# EAGLE design sensor-small (EAGLE 9.6.2)
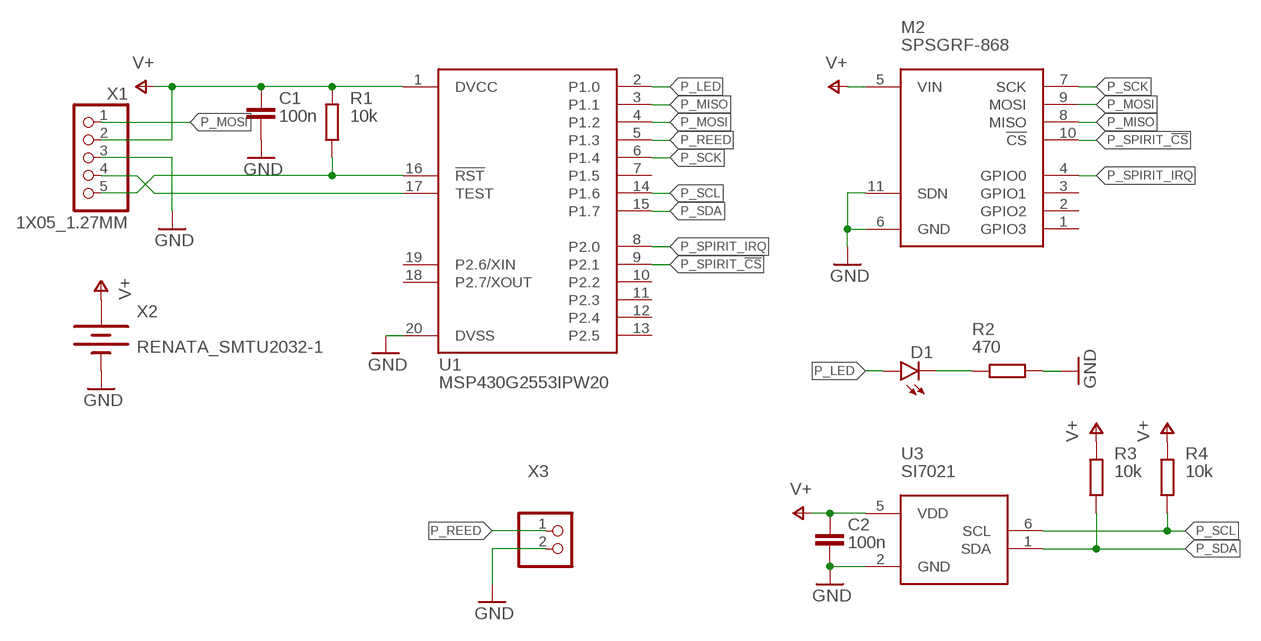
[diagram p0: schematic, sheet 1]

## Parts
C1  100n  C0603  [C0603]
C2  100n  C0603  [C0603]
D1  LEDCHIPLED_0805  [CHIPLED_0805]
M2  SPSGRF-868  [SPSGRF-868]
R1  10k  R0603  [R0603]
R2  470  R0603  [R0603]
R3  10k  R0603  [R0603]
R4  10k  R0603  [R0603]
U1  MSP430G2553IPW20  [PW20]
U3  SI7021  [DFN6-3X3]
X1  1X05_1.27MM  [1X05_1.27MM]
X2  RENATA_SMTU2032-1  [RENATA_SMTU2032-1]
X3  PINHD_2_RND  [1X02]

## Nets
GND: C1.2 C2.2 M2.6(GND) M2.11(SDN) R2.2 U1.20(DVSS) U3.2(GND) X1.3 X2.2(-) X3.2
N$1: D1.C R2.1
N$2: R1.1 U1.16(!RST!) X1.5
N$3: U1.17(TEST) X1.4
P_LED: D1.A U1.2(P1.0)
P_MISO: M2.8(MISO) U1.3(P1.1)
P_MOSI: M2.9(MOSI) U1.4(P1.2) X1.1
P_REED: U1.5(P1.3) X3.1
P_SCK: M2.7(SCK) U1.6(P1.4)
P_SCL: R4.1 U1.14(P1.6) U3.6(SCL)
P_SDA: R3.1 U1.15(P1.7) U3.1(SDA)
P_SPIRIT_!CS: M2.10(!CS) U1.9(P2.1)
P_SPIRIT_IRQ: M2.4(GPIO0) U1.8(P2.0)
V+: C1.1 C2.1 M2.5(VIN) R1.2 R3.2 R4.2 U1.1(DVCC) U3.5(VDD) X1.2 X2.1(+)
Unconnected: M2.1(GPIO3) M2.2(GPIO2) M2.3(GPIO1) U1.7(P1.5) U1.10(P2.2) U1.11(P2.3) U1.12(P2.4) U1.13(P2.5) U1.18(P2.7/XOUT) U1.19(P2.6/XIN)

## Library data of the parts
C1 C2 = rfr-lib-passive:C: Standard-SMD-Kondensatoren
D1 = led:LED: LED OSRAM: - CHIPLED LG R971, LG N971, LY N971, LG Q971, LY Q971, LO R971, LY R971 LH N974, LH R974 LS Q976, LO Q976, LY Q976 LO Q996 - Hyper CHIPLED LW Q18S LB Q993, LB Q99A, LB R99A - SideLED LS A670, LO A670, LY A670, LG A670, LP A670 LB A673, LV A673, LT A673, LW A673 LH A674 LY A675 LS A676, LA A676, LO A676, LY A676, LW A676 LS A679, LY A679, LG A679 - Hyper Micro SIDELED® LS Y876, LA Y876, LO Y876, LY Y876 LT Y87S - SmartLED LW L88C, LW L88S LB L89C, LB L89S, LG L890 LS L89K, LO L89K, LY L89K LS L896, LA L896, LO L896, LY L896 - TOPLED LS T670, LO T670, LY T670, LG T670, LP T670 LSG T670, LSP T670, LSY T670, LOP T670, LYG T670 LG T671, LOG T671, LSG T671 LB T673, LV T673, LT T673, LW T673 LH T674 LS T676, LA T676, LO T676, LY T676, LB T676, LH T676, LSB T676, LW T676 LB T67C, LV T67C, LT T67C, LS T67K, LO T67K, LY T67K, LW E67C LS E67B, LA E67B, LO E67B, LY E67B, LB E67C, LV E67C, LT E67C LW T67C LS T679, LY T679, LG T679 LS T770, LO T770, LY T770, LG T770, LP T770 LB T773, LV T773, LT T773, LW T773 LH T774 LS E675, LA E675, LY E675, LS T675 LS T776, LA T776, LO T776, LY T776, LB T776 LHGB T686 LT T68C, LB T68C - Hyper Mini TOPLED® LB M676 - Mini TOPLED Santana® LG M470 LS M47K, LO M47K, LY M47K Source: http://www.osram.convergy.de LUXEON: - LUMILED® LXK2-PW12-R00, LXK2-PW12-S00, LXK2-PW14-U00, LXK2-PW14-V00 LXK2-PM12-R00, LXK2-PM12-S00, LXK2-PM14-U00 LXK2-PE12-Q00, LXK2-PE12-R00, LXK2-PE12-S00, LXK2-PE14-T00, LXK2-PE14-U00 LXK2-PB12-K00, LXK2-PB12-L00, LXK2-PB12-M00, LXK2-PB14-N00, LXK2-PB14-P00, LXK2-PB14-Q00 LXK2-PR12-L00, LXK2-PR12-M00, LXK2-PR14-Q00, LXK2-PR14-R00 LXK2-PD12-Q00, LXK2-PD12-R00, LXK2-PD12-S00 LXK2-PH12-R00, LXK2-PH12-S00 LXK2-PL12-P00, LXK2-PL12-Q00, LXK2-PL12-R00 Source: www.luxeon.com KINGBRIGHT: KA-3528ASYC Source: www.kingbright.com
M2 = rfr-lib-radio:SPSGRF-868
R1-R4 = rfr-lib-passive:R: Standard-SMD-Widerstände
U1 = rfr-lib-digital:MSP430G2553: MSP430G2XX1 TSSOP (PW) 20 Pin Package
U3 = rfr-lib-sensors:SI7021
X1 = msp430-nrf-wsn-lib:1X05_1.27MM
X2 = msp430-nrf-wsn-lib:RENATA_SMTU2032-1
X3 = rfr-lib-connector:PINHD_2_RND

## Board
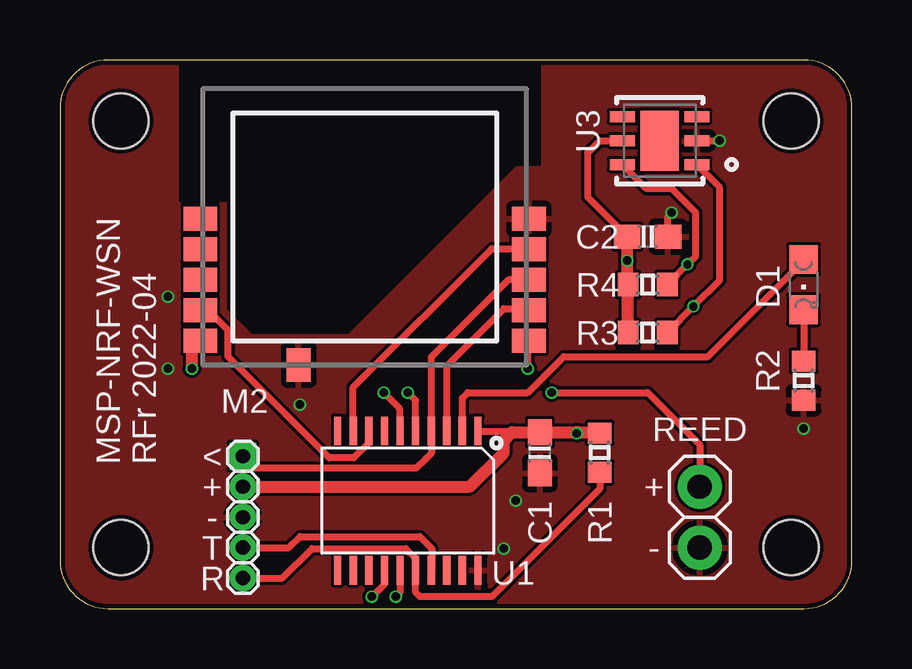
[diagram p1: board, top side]
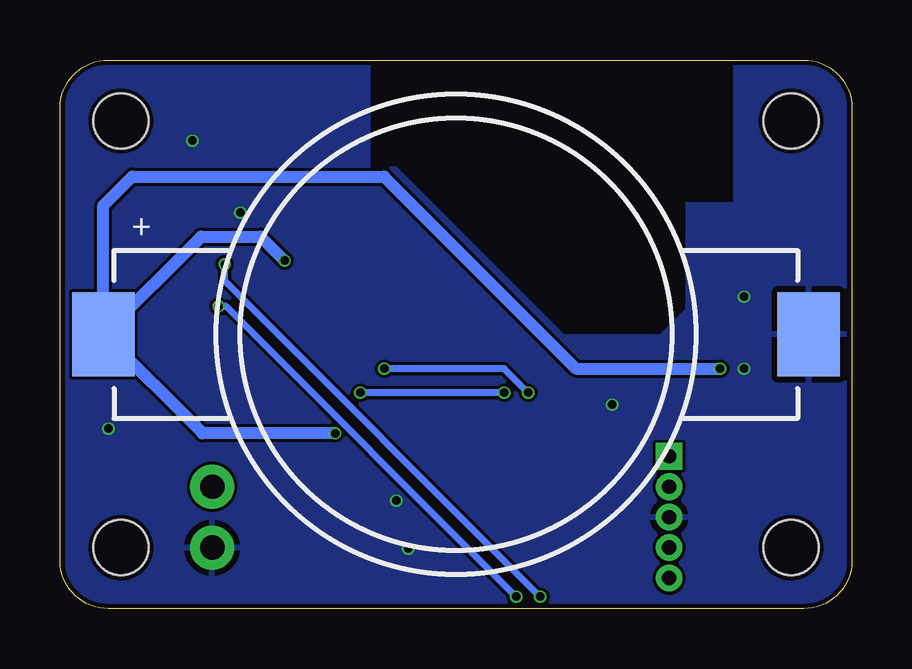
[diagram p2: board, bottom side, seen from below]

Size 33.02 x 22.86 mm. Coordinates in mm from the lower left corner, seen from the top.
Outline: 0,20.86 0,2 arc90 2,0 31.02,0 arc90 33.02,2 33.02,20.86 arc90 31.02,22.86 2,22.86 arc90 0,20.86
Copper layers (1*16): Top 0.035mm / dielectric 1.6mm / Bottom 0.035mm
Design rules "jlcpcb-2layers *": minimum track width 5mil, minimum drill 0.3mm, track to track 5mil, track to pad 5mil, pad to pad 5mil, via to via 5mil, smd to smd 5mil, copper to edge 0.2mm, drill to drill 6mil, minimum pad ring 10mil, minimum via ring 3mil, stop-mask expansion 4mil, vias tented up to drill 0.7mm, thermal gap 10mil
Holes 2.3 mm at 30.48,20.32 30.48,2.54 2.54,20.32 2.54,2.54
tRestrict: area 5,11.5 to 20,23
bRestrict: area 5,11.5 to 20,23

### Footprints (pad centres in the part's own frame; a part is rotated, then mirrored left to right if it is on the bottom)
C0603 = smd 1.1 x 1: 1 -0.85,0; 2 0.85,0
CHIPLED_0805 = smd 1.2 x 1.2: A 0,-1.05; C 0,1.05
SPSGRF-868 = smd 1.4 x 1: 1 -6.85,6.08; 2 -6.85,4.81; 3 -6.85,3.54; 4 -6.85,2.27; 5 -6.85,1; 7 6.85,1; 8 6.85,2.27; 9 6.85,3.54; 10 6.85,4.81; 11 6.85,6.08 | smd 1 x 1.4: 6 -2.75,0
R0603 = smd 0.87 x 0.98: 1 -0.815,0; 2 0.815,0
PW20 = smd 0.3 x 1.2: 1 -2.925,-2.9; 2 -2.275,-2.9; 3 -1.625,-2.9; 4 -0.975,-2.9; 5 -0.325,-2.9; 6 0.325,-2.9; 7 0.975,-2.9; 8 1.625,-2.9; 9 2.275,-2.9; 10 2.925,-2.9; 11 2.925,2.9; 12 2.275,2.9; 13 1.625,2.9; 14 0.975,2.9; 15 0.325,2.9; 16 -0.325,2.9; 17 -0.975,2.9; 18 -1.625,2.9; 19 -2.275,2.9; 20 -2.925,2.9
DFN6-3X3 = smd 1.05 x 0.45: 1 -1.55,1; 2 -1.55,0; 3 -1.55,-1; 4 1.55,-1; 5 1.55,0; 6 1.55,1 | smd 1.6 x 2.5: EXP 0,0
1X05_1.27MM = drill 0.6 square: 1 -2.54,0 | drill 0.6: 2 -1.27,0; 3 0,0; 4 1.27,0; 5 2.54,0
RENATA_SMTU2032-1 = smd 2.6 x 3.5: 1 -14.7,0; 2 14.7,0
1X02 = drill 1.016 pad 1.778: 1 -1.27,0; 2 1.27,0

### Placement (x,y rotation side)
C1  20,6.5 270 top
C2  24.5,15.5 0 top
D1  31,13.5 180 top
M2  12.7,10.16 0 top
R1  22.5,6.5 90 top
R2  31,9.5 270 top
R3  24.5,11.5 180 top
R4  24.5,13.5 180 top
U1  14.5,4.5 180 top
U3  25,19.5 180 top
X1  7.62,3.81 270 top
X2  16.51,11.43 0 bottom
X3  26.67,3.81 270 top

### Tracks (layer width: path | path; a pad name or v marks a point on that pad's centre or on a via)
GND  (via drill 0.35)
  Top 0.3: C2.2 25.35,16.35 v25.5,16.5 | U3.2 v27.5,19.5
  other vias: 4.5,13 4.5,10 10,8.5 18.5,2.5 19,4.5 31,7.5
  pour Top: -1,26.27 34,26.27 34,-1 -1,-1
  pour Bottom: 34.5,25.77 -0.5,25.77 -0.5,-1.5 34.5,-1.5
N$1
  Top 0.3: D1.C R2.1
N$2
  Top 0.3: X1.5 9.27,1.27 10.5,2.5 14.42,2.5 14.82,2.09 U1.16 14.82,0.68 15,0.5 18,0.5 22.5,5 R1.1
N$3
  Top 0.3: X1.4 9.54,2.54 10,3 15,3 15.5,2.5 15.5,1.62 U1.17
P_LED
  Top 0.3: U1.2 16.77,8.78 17,9 19.5,9 21,10.5 27,10.5 31,14.5 D1.A
P_MISO
  Top 0.3: U1.3 16.12,10.12 18.5,12.5 19.48,12.5 M2.8
P_MOSI
  Top 0.3: X1.1 8.12,5.85 14.85,5.85 15.25,6.25 15.5,6.5 15.5,7.38 U1.4 15.47,10.47 18.7,13.7 M2.9
P_REED  (via drill 0.35)
  Top 0.3: U1.5 14.82,8.68 v14.5,9 | v20.5,9 24.5,9 26.67,6.83 X3.1
  Bottom 0.3: v14.5,9 v20.5,9
P_SCK  (via drill 0.35)
  Top 0.3: U1.6 14.18,8.32 v13.5,9 | v19.5,10 19.5,11.11 M2.7
  Bottom 0.3: v13.5,9 14.5,10 v19.5,10
P_SCL  (via drill 0.35)
  Top 0.3: R4.1 v26.16,14.34 26.5,14.69 26.5,16.5 25.5,17.5 24.45,17.5 U3.6 | U1.14 13.53,1.02 v13,0.5
  Bottom 0.3: v13,0.5 26.16,13.66 v26.16,14.34
P_SDA  (via drill 0.35)
  Top 0.3: R3.1 v26.41,12.59 27.5,13.69 27.5,17.55 U3.1 | U1.15 14.18,0.68 v14,0.5
  Bottom 0.3: v14,0.5 26.09,12.59 v26.41,12.59
P_SPIRIT_!CS
  Top 0.3: U1.9 12.22,9.22 18,15 19.52,15 M2.10
P_SPIRIT_IRQ
  Top 0.3: U1.8 12.88,6.91 12.24,6.28 11.22,6.28 7,10.5 7,11.6 6.17,12.43 M2.4
V+  (via drill 0.35)
  Top 0.3: C2.1 22,17.15 22,19 22.5,19.5 U3.5 | U1.1 18.8,7.4 18.85,7.35
  Top 0.5: X1.2 17.08,5.08 18.5,6.5 18.5,7 18.85,7.35 C1.1 21.5,7.35 v21.55,7.3 21.6,7.35 22.46,7.35 R1.2 | R3.2 R4.2 23.65,13.54 v23.65,14.5 C2.1 | v5.5,10 5.5,10.81 M2.5
  Bottom 0.5: v21.55,7.3 27.08,7.3 X2.1 | X2.1 27.14,15.5 24.65,15.5 v23.65,14.5 | v5.5,10 11.5,10 19.5,18 30,18 31.21,16.79 31.21,11.5 X2.1

### Text on the board
tPlace: REED | MSP-NRF-WSN | RFr 2022-04 | < | + | + | - | T | - | R